# Altium project L-Stick.PrjPCB
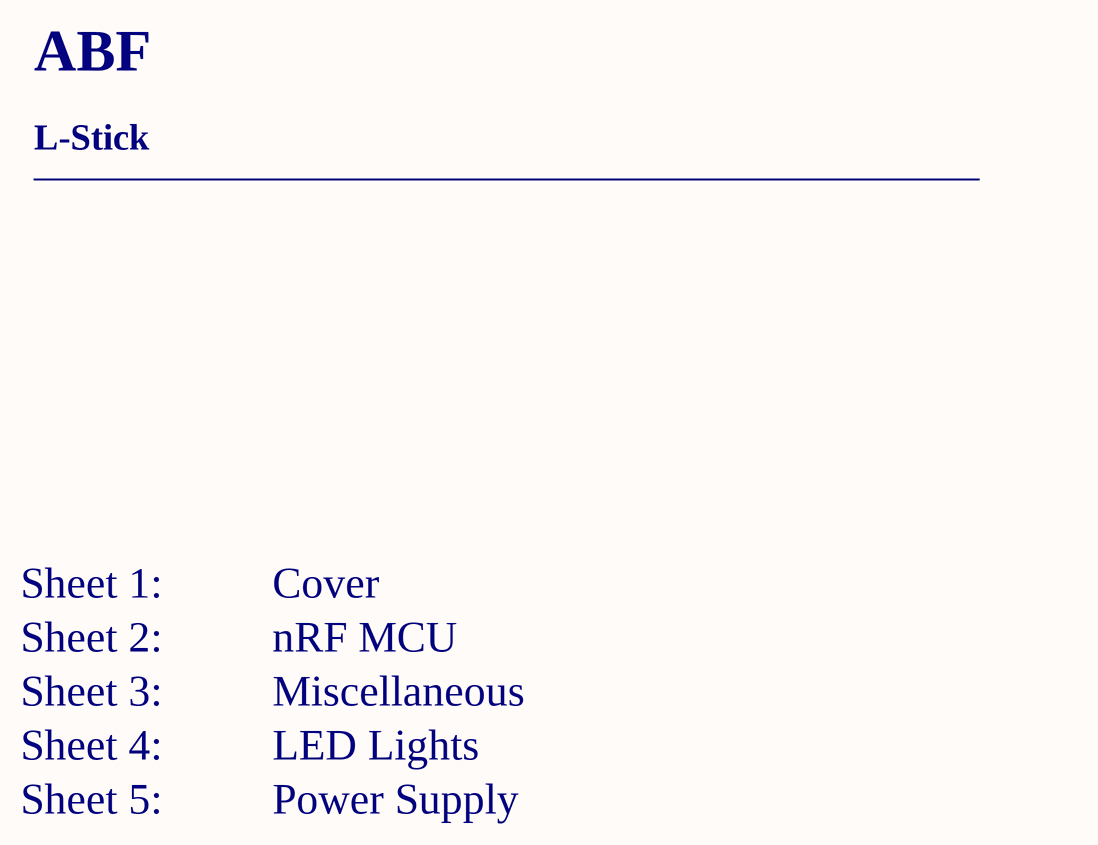
[diagram p0: L-Stick_sheet1_cover.SchDoc]
5 sheets, 111 parts. Net scope: flat (ports and power ports of the same name join across sheets).
Board file: L-Stick.PcbDoc
Sheets:
  L-Stick_sheet1_cover.SchDoc
  L-Stick_sheet2_mcu.SchDoc
  L-Stick_sheet3_misc.SchDoc
  L-Stick_sheet4_leds.SchDoc
  L-Stick_sheet5_power_supply.SchDoc

## Sheet L-Stick_sheet1_cover.SchDoc: L-Stick - Cover
size A4; DocumentNumber: 1; Revision: 1.0.0; SheetNumber: 1; SheetTotal: 5; DrawnBy: SU; DocumentSize: A4; PCAName: L-Stick

### Notes on the sheet
- ABF
- L-Stick
- ___________________________________________
- Sheet 1:          Cover
- Sheet 2:          nRF MCU
- Sheet 3:          Miscellaneous
- Sheet 4:          LED Lights
- Sheet 5:          Power Supply
- Title
- Size:
- Date:
- A4
- Number:
- Time:
- Revision:
- Sheet
- of
- File:

## Sheet L-Stick_sheet2_mcu.SchDoc: L-Stick - nRF MCU
size A4; DocumentNumber: 2; Revision: 1.0.0; SheetNumber: 2; SheetTotal: 5; DrawnBy: SU; DocumentSize: A4; PCAName: L-Stick
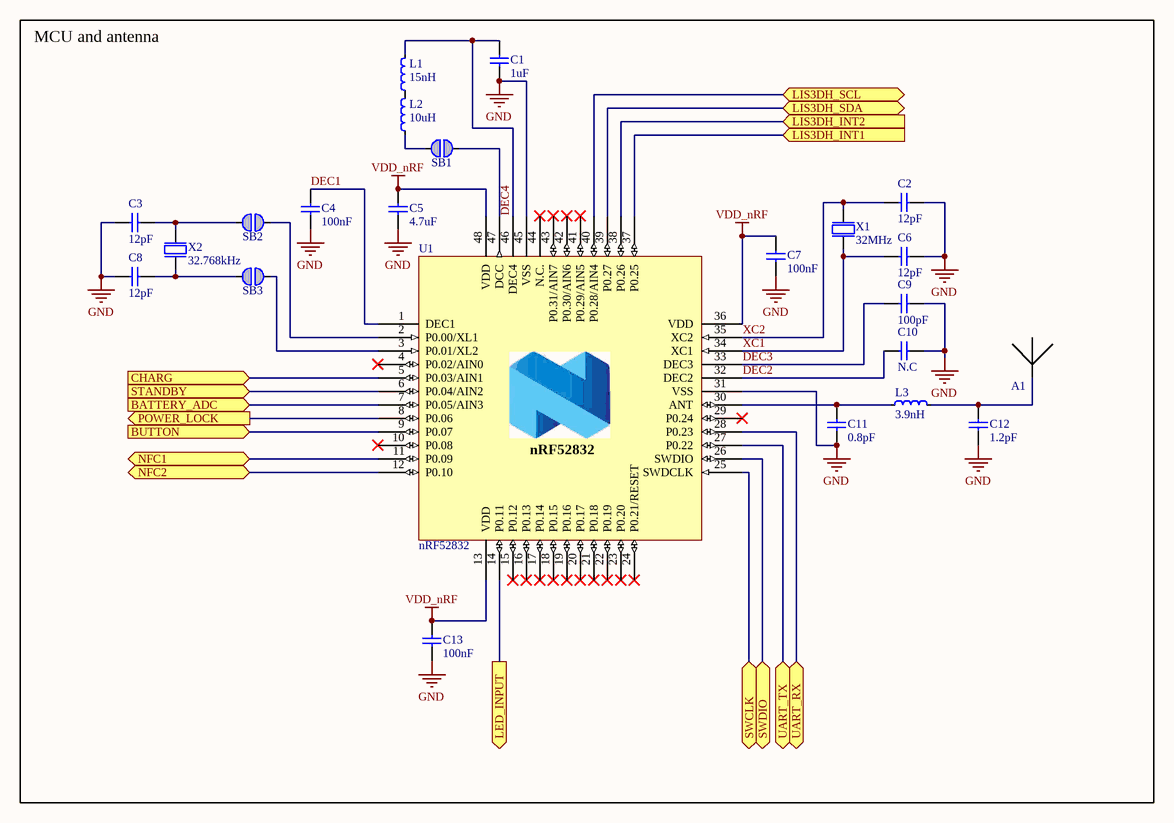
[diagram p1: L-Stick_sheet2_mcu.SchDoc]

### Parts
A1  (no value)  [Antenna]  (no BOM)
C1  1uF  [0603C]
C2  12pF  [0402C]
C3  12pF  [0402C]
C4  100nF  [0402C]
C5  4.7uF  [0603C]
C6  12pF  [0402C]
C7  100nF  [0402C]
C8  12pF  [0402C]
C9  100pF  [0402C]
C10  N.C  [0402C]
C11  0.8pF  [0402C]
C12  1.2pF  [0402C]
C13  100nF  [0402C]
L1  15nH  [0402L]
L2  10uH  [0603L]
L3  3.9nH  [0402L]
SB1  Solderbridge  [Solderbridge]  (value not drawn)  (no BOM)
SB2  Solderbridge  [Solderbridge]  (value not drawn)  (no BOM)
SB3  Solderbridge  [Solderbridge]  (value not drawn)  (no BOM)
U1  nRF52832  [QFN40P600X600X90-48N]
X1  32MHz  [XTAL_2016]
X2  32.768kHz  [XTAL_2012]

### Blocks framed on the sheet
MCU and antenna: A1 C1-C13 L1-L3 SB1-SB3 U1 X1 X2

### Ports
BATTERY_ADC (in), BUTTON (in), CHARG (in), LED_INPUT (out), LIS3DH_INT1 (in), LIS3DH_INT2 (in), LIS3DH_SCL (bidir), LIS3DH_SDA (bidir), NFC1 (bidir), NFC2 (bidir), POWER_LOCK (out), STANDBY (in), SWCLK (bidir), SWDIO (bidir), UART_RX (bidir), UART_TX (bidir)

### Nets
GND: C1.1 C2.2 C3.1 C4.1 C5.1 C6.2 C7.1 C8.1 C9.2 C10.2 C11.1 C12.1 C13.1 U1.31(VSS) U1.45(VSS) U1.49(GND) X1.2(GND) X1.4(GND)
VDD_nRF: C5.2 C7.2 C13.2 U1.13(VDD) U1.36(VDD) U1.48(VDD)
DEC1: C4.2 U1.1(DEC1)
DEC2: C10.1 U1.32(DEC2)
DEC3: C9.1 U1.33(DEC3)
DEC4: C1.2 L1.2 U1.46(DEC4)
XC1: C6.1 U1.34(XC1) X1.1(inp)
XC2: C2.1 U1.35(XC2) X1.3(out)
NetA1_1: A1.1 C12.2 L3.2
NetC3_2: C3.2 SB2.1 X2.2(out)
NetC8_2: C8.2 SB3.1 X2.1(inp)
NetC11_2: C11.2 L3.1 U1.30(ANT)
NetC33_2: U1.37(P0.25) ; port LIS3DH_INT1
NetC34_2: U1.38(P0.26) ; port LIS3DH_INT2
NetC35_1: U1.11(P0.09) ; port NFC1
NetC36_2: U1.12(P0.10) ; port NFC2
NetC47_2: U1.9(P0.07) ; port BUTTON
NetD1_1: U1.8(P0.06) ; port POWER_LOCK
NetJ1_2: U1.26(SWDIO) ; port SWDIO
NetJ1_3: U1.25(SWDCLK) ; port SWCLK
NetL1_1: L1.1 L2.2
NetL2_1: L2.1 SB1.1
NetLIGHT1_4: U1.14(P0.11) ; port LED_INPUT
NetP2_2: U1.28(P0.23) ; port UART_RX
NetP2_3: U1.27(P0.22) ; port UART_TX
NetR1_1: U1.40(P0.28/AIN4) ; port LIS3DH_SCL
NetR2_1: U1.39(P0.27) ; port LIS3DH_SDA
NetR8_2: U1.7(P0.05/AIN3) ; port BATTERY_ADC
NetSB1_2: SB1.2 U1.47(DCC)
NetSB2_2: SB2.2 U1.2(P0.00/XL1)
NetSB3_2: SB3.2 U1.3(P0.01/XL2)
NetU1_5: U1.5(P0.03/AIN1) ; port CHARG
NetU1_6: U1.6(P0.04/AIN2) ; port STANDBY

Not connected (* = marked no-connect by the designer): U1 4(P0.02/AIN0)* 10(P0.08)* 15(P0.12)* 16(P0.13)* 17(P0.14)* 18(P0.15)* 19(P0.16)* 20(P0.17)* 21(P0.18)* 22(P0.19)* 23(P0.20)* 24(P0.21/RESET)* 29(P0.24)* 41(P0.29/AIN5)* 42(P0.30/AIN6)* 43(P0.31/AIN7)* 44(N.C.)*

### Notes on the sheet
- Title
- Size:
- Date:
- A4
- Number:
- Time:
- Revision:
- Sheet
- of
- File:

### Library data of the parts
A1 = Antenna: 2.45 GHz PCB antenna
C1 C5 = CAP_0603: Capacitor
  C1: Value: 1uF
  C5: Value: 4.7uF
C2-C4 C6-C13 = CAP_0402: Capacitor
  C2 C3 C6 C8: Value: 12pF
  C4 C7 C13: Value: 100nF
  C9: Value: 100pF
  C10: Value: N.C
  C11: Value: 0.8pF
  C12: Value: 1.2pF
L1 L3 = IND_0402: Inductor
  L1: Value: 15nH
  L3: Value: 3.9nH
L2 = IND_0603: Inductor; Value: 10uH
U1 = nRF52832_QFAA: Chip, nRF52832, Multi-protocol Bluetooth Low Energy, ANT and 2.4GHz proprietary system-on-chip; Value: nRF52832
X1 = XTAL_SMD2016: XTAL SMD 2016, 32MHz, Cl=8pF, Tot: ±40ppm; Value: 32MHz
X2 = XTAL_SMD2012: XTAL SMD 2012, 32.768kHz, 9pF, ±20ppm; Value: 32.768kHz
SB1-SB3 = SOLDERBRIDGE: Value: Solderbridge

## Sheet L-Stick_sheet3_misc.SchDoc: L-Stick - Miscellaneous
size A4; DocumentNumber: 3; Revision: 1.0.0; SheetNumber: 3; SheetTotal: 5; DrawnBy: SU; DocumentSize: A4; PCAName: L-Stick
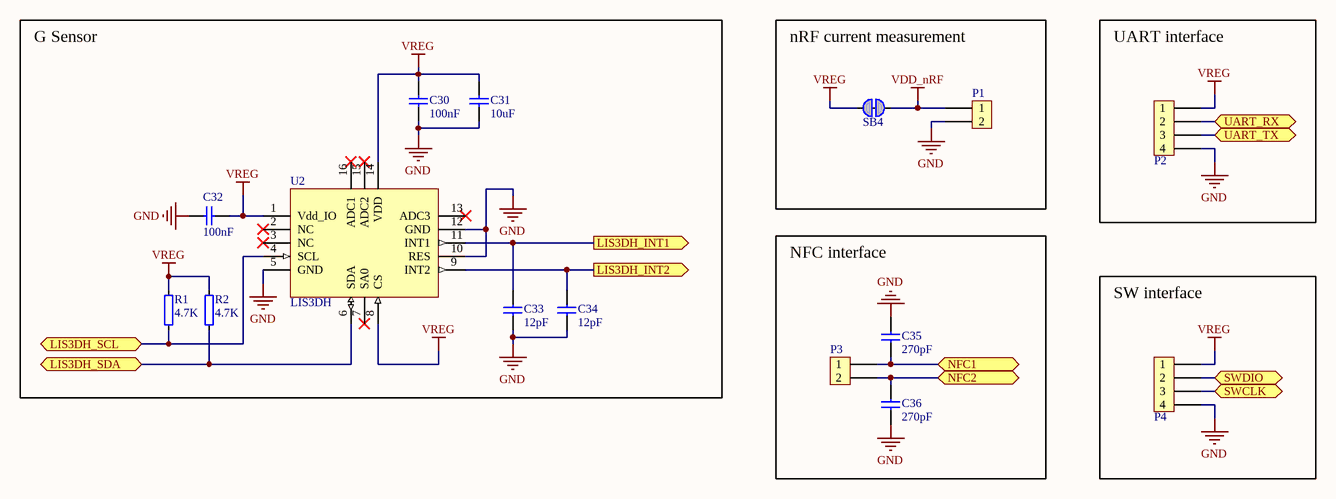
[diagram p2: L-Stick_sheet3_misc.SchDoc]

### Parts
C30  100nF  [0402C]
C31  10uF  [0603C]
C32  100nF  [0402C]
C33  12pF  [0402C]
C34  12pF  [0402C]
C35  270pF  [0402C]
C36  270pF  [0402C]
P1  (no value)  [LEG_2]  (no BOM)
P2  Header_4_2.54  [HEADER_4]  (value not drawn)
P3  (no value)  [TP_2x1mm_TH]  (no BOM)
P4  Header_4_2.54  [HEADER_4]  (value not drawn)
R1  4.7K  [0402R]
R2  4.7K  [0402R]
SB4  Solderbridge  [Solderbridge_Shorted]  (value not drawn)  (net tie, no BOM)
U2  LIS3DH  [LGA-16]

### Blocks framed on the sheet
G Sensor: C30-C34 R1 R2 U2
nRF current measurement: P1 SB4
UART interface: P2
NFC interface: C35 C36 P3
SW interface: P4

### Ports
LIS3DH_INT1 (out), LIS3DH_INT2 (out), LIS3DH_SCL (bidir), LIS3DH_SDA (bidir), NFC1 (bidir), NFC2 (bidir), SWCLK (bidir), SWDIO (bidir), UART_RX (bidir), UART_TX (bidir)

### Nets
GND: C30.1 C31.1 C32.1 C33.1 C34.1 C35.2 C36.1 P1.2 P2.4 P4.4 U2.5(GND) U2.10(RES) U2.12(GND)
VDD_nRF: P1.1 SB4.2
VREG: C30.2 C31.2 C32.2 P2.1 P4.1 R1.2 R2.2 SB4.1 U2.1(Vdd_IO) U2.8(CS) U2.14(VDD)
NetC33_2: C33.2 U2.11(INT1) ; port LIS3DH_INT1
NetC34_2: C34.2 U2.9(INT2) ; port LIS3DH_INT2
NetC35_1: C35.1 P3.1 ; port NFC1
NetC36_2: C36.2 P3.2 ; port NFC2
NetJ1_2: P4.2 ; port SWDIO
NetJ1_3: P4.3 ; port SWCLK
NetP2_2: P2.2 ; port UART_RX
NetP2_3: P2.3 ; port UART_TX
NetR1_1: R1.1 U2.4(SCL) ; port LIS3DH_SCL
NetR2_1: R2.1 U2.6(SDA) ; port LIS3DH_SDA

Not connected (* = marked no-connect by the designer): U2 2(NC)* 3(NC)* 7(SA0)* 13(ADC3)* 15(ADC2)* 16(ADC1)*

### Notes on the sheet
- Title
- Size:
- Date:
- A4
- Number:
- Time:
- Revision:
- Sheet
- of
- File:

### Library data of the parts
C30 C32-C36 = CAP_0402: Capacitor
  C30 C32: Value: 100nF
  C33 C34: Value: 12pF
  C35 C36: Value: 270pF
C31 = CAP_0603: Capacitor; Value: 10uF
P1 P3 = LEG_2: External Solder Pad
P2 P4 = Header_4: Value: Header_4_2.54
R1 R2 = RES_0402: Resistor; Value: 4.7K
SB4 = SOLDERBRIDGE_SHORTED: Shorted Solderbridge; Value: Solderbridge
U2 = LIS3DH: Chip, LIS3DH, 3-axis - ±2g/±4g/±8g/±16g digital output femto accelerometer; Value: LIS3DH

## Sheet L-Stick_sheet4_leds.SchDoc: L-Stick - LED Lights
size A4; DocumentNumber: 4; Revision: 1.0.0; SheetNumber: 4; SheetTotal: 5; DrawnBy: SU; DocumentSize: A4; PCAName: L-Stick
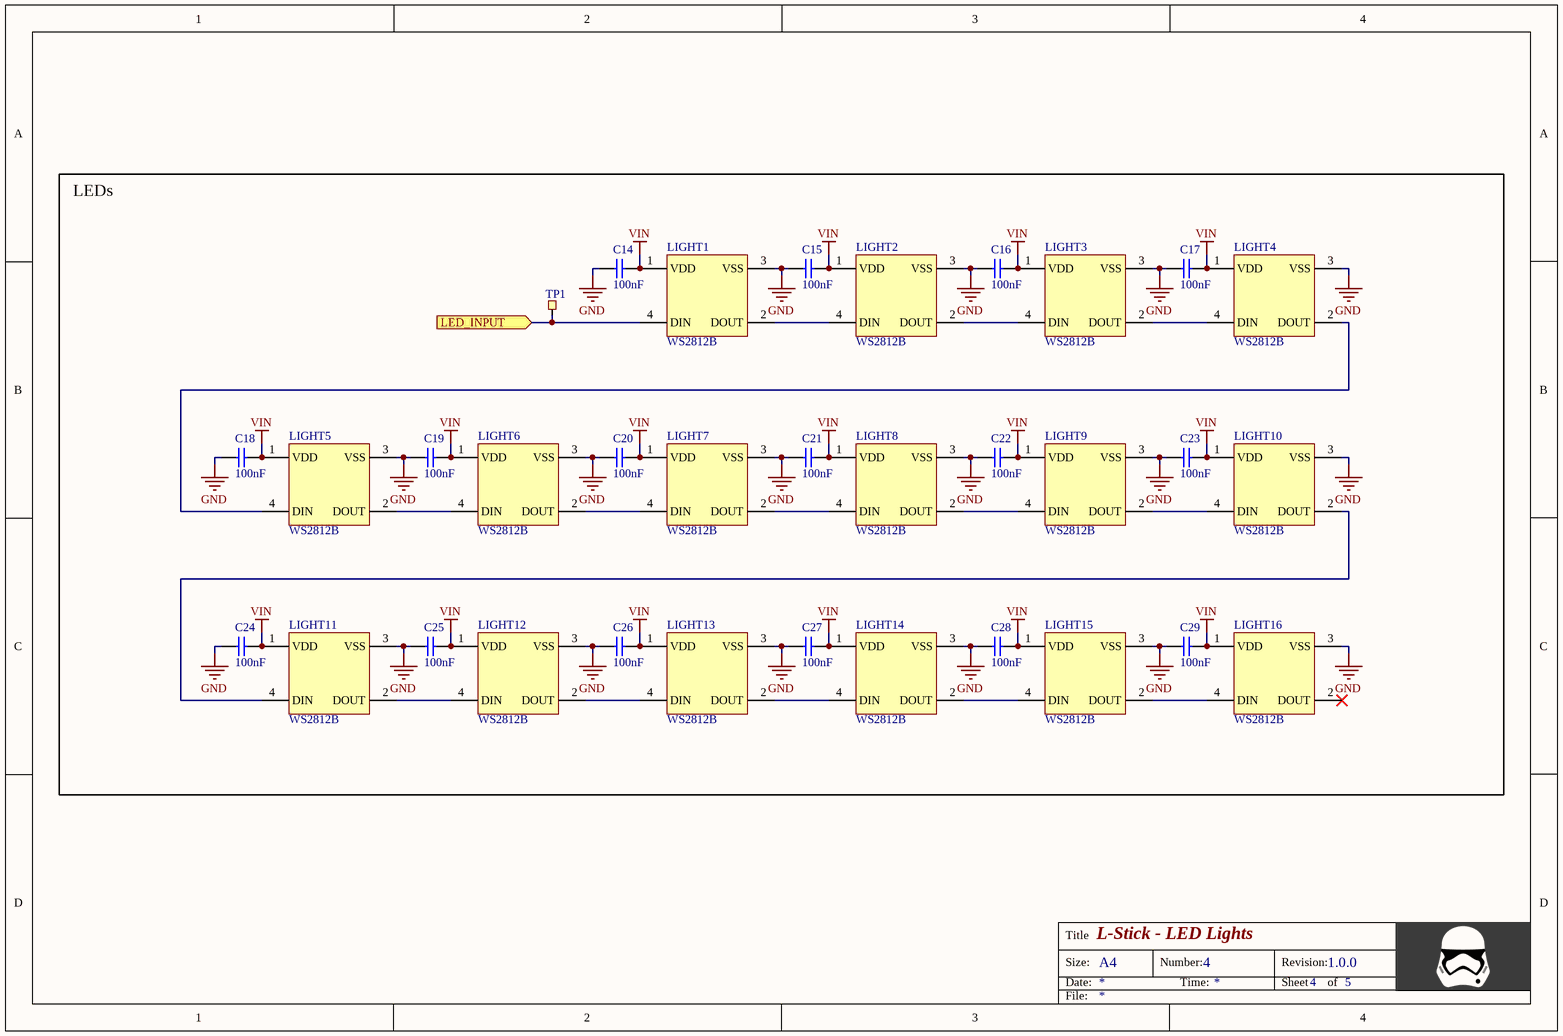
[diagram p3: L-Stick_sheet4_leds.SchDoc]

### Parts
C14  100nF  [0402C]
C15  100nF  [0402C]
C16  100nF  [0402C]
C17  100nF  [0402C]
C18  100nF  [0402C]
C19  100nF  [0402C]
C20  100nF  [0402C]
C21  100nF  [0402C]
C22  100nF  [0402C]
C23  100nF  [0402C]
C24  100nF  [0402C]
C25  100nF  [0402C]
C26  100nF  [0402C]
C27  100nF  [0402C]
C28  100nF  [0402C]
C29  100nF  [0402C]
LIGHT1  WS2812B  [WS2812B]
LIGHT2  WS2812B  [WS2812B]
LIGHT3  WS2812B  [WS2812B]
LIGHT4  WS2812B  [WS2812B]
LIGHT5  WS2812B  [WS2812B]
LIGHT6  WS2812B  [WS2812B]
LIGHT7  WS2812B  [WS2812B]
LIGHT8  WS2812B  [WS2812B]
LIGHT9  WS2812B  [WS2812B]
LIGHT10  WS2812B  [WS2812B]
LIGHT11  WS2812B  [WS2812B]
LIGHT12  WS2812B  [WS2812B]
LIGHT13  WS2812B  [WS2812B]
LIGHT14  WS2812B  [WS2812B]
LIGHT15  WS2812B  [WS2812B]
LIGHT16  WS2812B  [WS2812B]
TP1  Ø1.5mm,SMD  [TP_SMD]  (value not drawn)  (no BOM)

### Blocks framed on the sheet
LEDs: C14-C29 LIGHT1-LIGHT16 TP1

### Ports
LED_INPUT (in)

### Nets
GND: C14.1 C15.1 C16.1 C17.1 C18.1 C19.1 C20.1 C21.1 C22.1 C23.1 C24.1 C25.1 C26.1 C27.1 C28.1 C29.1 LIGHT1.3(VSS) LIGHT2.3(VSS) LIGHT3.3(VSS) LIGHT4.3(VSS) LIGHT5.3(VSS) LIGHT6.3(VSS) LIGHT7.3(VSS) LIGHT8.3(VSS) LIGHT9.3(VSS) LIGHT10.3(VSS) LIGHT11.3(VSS) LIGHT12.3(VSS) LIGHT13.3(VSS) LIGHT14.3(VSS) LIGHT15.3(VSS) LIGHT16.3(VSS)
VIN: C14.2 C15.2 C16.2 C17.2 C18.2 C19.2 C20.2 C21.2 C22.2 C23.2 C24.2 C25.2 C26.2 C27.2 C28.2 C29.2 LIGHT1.1(VDD) LIGHT2.1(VDD) LIGHT3.1(VDD) LIGHT4.1(VDD) LIGHT5.1(VDD) LIGHT6.1(VDD) LIGHT7.1(VDD) LIGHT8.1(VDD) LIGHT9.1(VDD) LIGHT10.1(VDD) LIGHT11.1(VDD) LIGHT12.1(VDD) LIGHT13.1(VDD) LIGHT14.1(VDD) LIGHT15.1(VDD) LIGHT16.1(VDD)
NetLIGHT1_2: LIGHT1.2(DOUT) LIGHT2.4(DIN)
NetLIGHT1_4: LIGHT1.4(DIN) TP1.1 ; port LED_INPUT
NetLIGHT2_2: LIGHT2.2(DOUT) LIGHT3.4(DIN)
NetLIGHT3_2: LIGHT3.2(DOUT) LIGHT4.4(DIN)
NetLIGHT4_2: LIGHT4.2(DOUT) LIGHT5.4(DIN)
NetLIGHT5_2: LIGHT5.2(DOUT) LIGHT6.4(DIN)
NetLIGHT6_2: LIGHT6.2(DOUT) LIGHT7.4(DIN)
NetLIGHT7_2: LIGHT7.2(DOUT) LIGHT8.4(DIN)
NetLIGHT8_2: LIGHT8.2(DOUT) LIGHT9.4(DIN)
NetLIGHT9_2: LIGHT9.2(DOUT) LIGHT10.4(DIN)
NetLIGHT10_2: LIGHT10.2(DOUT) LIGHT11.4(DIN)
NetLIGHT11_2: LIGHT11.2(DOUT) LIGHT12.4(DIN)
NetLIGHT12_2: LIGHT12.2(DOUT) LIGHT13.4(DIN)
NetLIGHT13_2: LIGHT13.2(DOUT) LIGHT14.4(DIN)
NetLIGHT14_2: LIGHT14.2(DOUT) LIGHT15.4(DIN)
NetLIGHT15_2: LIGHT15.2(DOUT) LIGHT16.4(DIN)

Not connected (* = marked no-connect by the designer): LIGHT16 2(DOUT)*

### Notes on the sheet
- Title
- Size:
- Date:
- A4
- Number:
- Time:
- Revision:
- Sheet
- of
- File:

### Library data of the parts
C14-C29 = CAP_0402: Capacitor; Value: 100nF
LIGHT1-LIGHT16 = WS2812B: Integrated RGB LED; Value: WS2812B
TP1 = TP_SMD_Ø1.0MM: 1.0mm circular SMD testpad; Value: Ø1.5mm,SMD

## Sheet L-Stick_sheet5_power_supply.SchDoc: L-Stick - Power Supply
size A4; DocumentNumber: 5; Revision: 1.0.0; SheetNumber: 5; SheetTotal: 5; DrawnBy: SU; DocumentSize: A4; PCAName: L-Stick
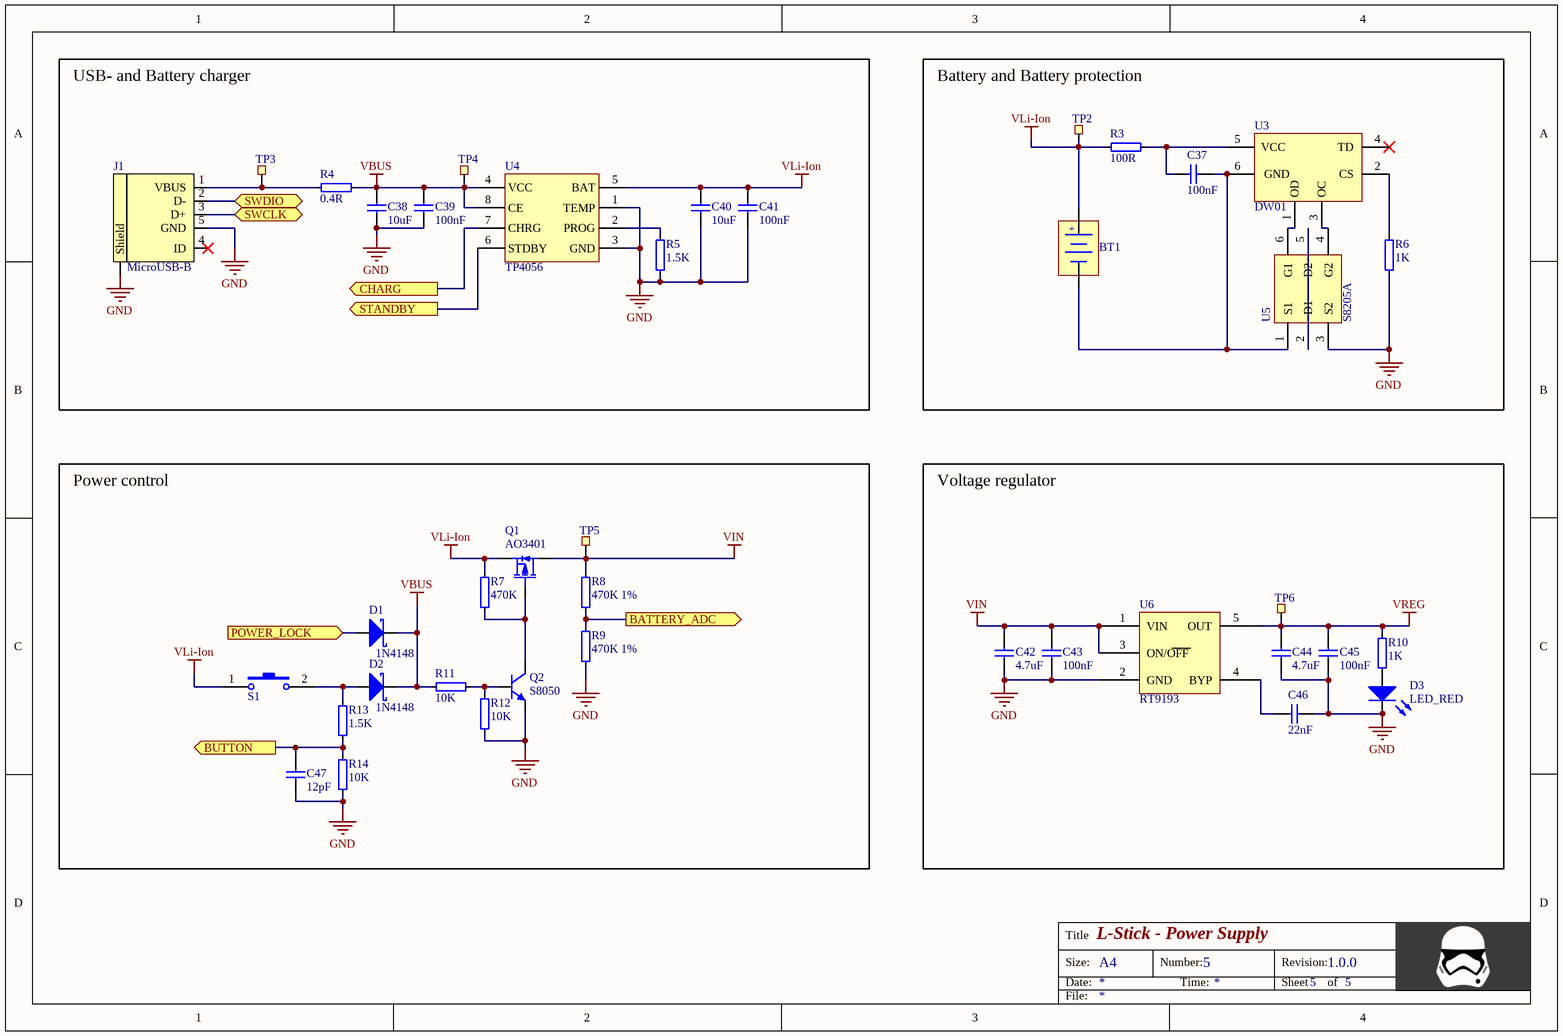
[diagram p4: L-Stick_sheet5_power_supply.SchDoc]

### Parts
BT1  XH2.54_2PIN  [XH2.54_2PIN]  (value not drawn)
C37  100nF  [0402C]
C38  10uF  [0603C]
C39  100nF  [0402C]
C40  10uF  [0603C]
C41  100nF  [0402C]
C42  4.7uF  [0603C]
C43  100nF  [0402C]
C44  4.7uF  [0603C]
C45  100nF  [0402C]
C46  22nF  [0402C]
C47  12pF  [0402C]
D1  1N4148  [SOD-523]
D2  1N4148  [SOD-523]
D3  LED_RED  [LED_RED_0603]
J1  MicroUSB-B  [USB-Micro]
Q1  AO3401  [SOT-23A]
Q2  S8050  [SOT-23A]
R3  100R  [0402R]
R4  0.4R  [1206R]
R5  1.5K  [0402R]
R6  1K  [0402R]
R7  470K  [0402R]
R8  470K 1%  [0402R]
R9  470K 1%  [0402R]
R10  1K  [0402R]
R11  10K  [0402R]
R12  10K  [0402R]
R13  1.5K  [0402R]
R14  10K  [0402R]
S1  Side Button  [SW_SIDE]  (value not drawn)
TP2  Ø1.5mm,SMD  [TP_SMD]  (value not drawn)  (no BOM)
TP3  Ø1.5mm,SMD  [TP_SMD]  (value not drawn)  (no BOM)
TP4  Ø1.5mm,SMD  [TP_SMD]  (value not drawn)  (no BOM)
TP5  Ø1.5mm,SMD  [TP_SMD]  (value not drawn)  (no BOM)
TP6  Ø1.5mm,SMD  [TP_SMD]  (value not drawn)  (no BOM)
U3  DW01  [SOT23-6]
U4  TP4056  [SOIC8E]
U5  S8205A  [SOT23-6]
U6  RT9193  [SOT23-5]

### Blocks framed on the sheet
USB- and Battery charger: C38-C41 J1 R4 R5 TP3 TP4 U4
Battery and Battery protection: BT1 C37 R3 R6 TP2 U3 U5
Power control: C47 D1 D2 Q1 Q2 R7-R9 R11-R14 S1 TP5
Voltage regulator: C42-C46 D3 R10 TP6 U6

### Ports
BATTERY_ADC (out), BUTTON (out), CHARG (out), POWER_LOCK (in), STANDBY (out), SWCLK (bidir), SWDIO (bidir)

### Nets
GND: C38.1 C39.1 C40.1 C41.1 C42.1 C43.1 C44.1 C45.1 C46.2 C47.1 D3.2(K) J1.5(GND) J1.6(Shield) Q2.2(E) R5.1 R6.1 R9.2 R12.2 R14.1 U4.1(TEMP) U4.3(GND) U5.3(S2) U6.2(GND)
VBUS: C38.2 C39.2 D1.2(K) D2.2(K) R4.2 R11.2 TP4.1 U4.4(VCC) U4.8(CE)
VIN: C42.2 C43.2 Q1.3(D) R8.1 TP5.1 U6.1(VIN) U6.3(ON/OFF)
VLi-Ion: BT1.1(+) C40.2 C41.2 Q1.2(S) R3.1 R7.1 S1.1 TP2.1 U4.5(BAT)
VREG: C44.2 C45.2 R10.2 TP6.1 U6.5(OUT)
NetBT1_2: BT1.2(-) C37.2 U3.6(GND) U5.1(S1)
NetC37_1: C37.1 R3.2 U3.5(VCC)
NetC46_1: C46.1 U6.4(BYP)
NetC47_2: C47.2 R13.1 R14.2 ; port BUTTON
NetD1_1: D1.1(A) ; port POWER_LOCK
NetD2_1: D2.1(A) R13.2 S1.2
NetD3_1: D3.1(A) R10.1
NetJ1_1: J1.1(VBUS) R4.1 TP3.1
NetJ1_2: J1.2(D-) ; port SWDIO
NetJ1_3: J1.3(D+) ; port SWCLK
NetQ1_1: Q1.1(G) Q2.3(C) R7.2
NetQ2_1: Q2.1(B) R11.1 R12.1
NetR5_2: R5.2 U4.2(PROG)
NetR6_2: R6.2 U3.2(CS)
NetR8_2: R8.2 R9.1 ; port BATTERY_ADC
NetU1_5: U4.7(CHRG) ; port CHARG
NetU1_6: U4.6(STDBY) ; port STANDBY
NetU3_1: U3.1(OD) U5.6(G1)
NetU3_3: U3.3(OC) U5.4(G2)
NetU5_2: U5.2(D1) U5.5(D2)

Not connected (* = marked no-connect by the designer): J1 4(ID)*; U3 4(TD)*

### Notes on the sheet
- Title
- Size:
- Date:
- A4
- Number:
- Time:
- Revision:
- Sheet
- of
- File:

### Library data of the parts
BT1 = Battery: Multicell Battery Base; Value: XH2.54_2PIN
C37 C39 C41 C43 C45-C47 = CAP_0402: Capacitor
  C37 C39 C41 C43 C45: Value: 100nF
  C46: Value: 22nF
  C47: Value: 12pF
C38 C40 C42 C44 = CAP_0603: Capacitor
  C38 C40: Value: 10uF
  C42 C44: Value: 4.7uF
D1 D2 = Diode Schottky: Value: 1N4148
J1 = MiniUSB-AB-SMT: MicroUSB-B-SMT; Value: MicroUSB-B
Q1 = MOSFET-P: P-MOS, AO3401, P-Channel MOSFET; Value: AO3401
Q2 = NPN: NPN, S8050, NPN Bipolar Transistor; Value: S8050
R3 R5-R14 = RES_0402: Resistor
  R3: Value: 100R
  R5 R13: Value: 1.5K
  R6 R10: Value: 1K
  R7: Value: 470K
  R8 R9: Value: 470K 1%
  R11 R12 R14: Value: 10K
R4 = RES_1206: Resistor; Value: 0.4R
S1 = SW-PB: Value: Side Button
TP2-TP6 = TP_SMD_Ø1.0MM: 1.0mm circular SMD testpad; Value: Ø1.5mm,SMD
U3 = DW01: Chip, DW01, Battery Protection IC; Value: DW01
U4 = TP4056: Chip, TP4056, Battery charging chip; Value: TP4056
U5 = S8205A: Chip, S8205A; Value: S8205A
U6 = RT9193: Chip, RT9193, LDO Regulator; Value: RT9193
D3 = LED_RED: Value: LED_RED

## Nets that join several sheets
GND: L-Stick_sheet2_mcu (18 pins), L-Stick_sheet3_misc (13 pins), L-Stick_sheet4_leds (32 pins), L-Stick_sheet5_power_supply (23 pins)
VDD_nRF: L-Stick_sheet2_mcu (6 pins), L-Stick_sheet3_misc (P1.1 SB4.2)
VIN: L-Stick_sheet4_leds (32 pins), L-Stick_sheet5_power_supply (7 pins)
VREG: L-Stick_sheet3_misc (11 pins), L-Stick_sheet5_power_supply (5 pins)
NetC33_2: L-Stick_sheet2_mcu (U1.37), L-Stick_sheet3_misc (C33.2 U2.11)
NetC34_2: L-Stick_sheet2_mcu (U1.38), L-Stick_sheet3_misc (C34.2 U2.9)
NetC35_1: L-Stick_sheet2_mcu (U1.11), L-Stick_sheet3_misc (C35.1 P3.1)
NetC36_2: L-Stick_sheet2_mcu (U1.12), L-Stick_sheet3_misc (C36.2 P3.2)
NetC47_2: L-Stick_sheet2_mcu (U1.9), L-Stick_sheet5_power_supply (C47.2 R13.1 R14.2)
NetD1_1: L-Stick_sheet2_mcu (U1.8), L-Stick_sheet5_power_supply (D1.1)
NetJ1_2: L-Stick_sheet2_mcu (U1.26), L-Stick_sheet3_misc (P4.2), L-Stick_sheet5_power_supply (J1.2)
NetJ1_3: L-Stick_sheet2_mcu (U1.25), L-Stick_sheet3_misc (P4.3), L-Stick_sheet5_power_supply (J1.3)
NetLIGHT1_4: L-Stick_sheet2_mcu (U1.14), L-Stick_sheet4_leds (LIGHT1.4 TP1.1)
NetP2_2: L-Stick_sheet2_mcu (U1.28), L-Stick_sheet3_misc (P2.2)
NetP2_3: L-Stick_sheet2_mcu (U1.27), L-Stick_sheet3_misc (P2.3)
NetR1_1: L-Stick_sheet2_mcu (U1.40), L-Stick_sheet3_misc (R1.1 U2.4)
NetR2_1: L-Stick_sheet2_mcu (U1.39), L-Stick_sheet3_misc (R2.1 U2.6)
NetR8_2: L-Stick_sheet2_mcu (U1.7), L-Stick_sheet5_power_supply (R8.2 R9.1)
NetU1_5: L-Stick_sheet2_mcu (U1.5), L-Stick_sheet5_power_supply (U4.7)
NetU1_6: L-Stick_sheet2_mcu (U1.6), L-Stick_sheet5_power_supply (U4.6)